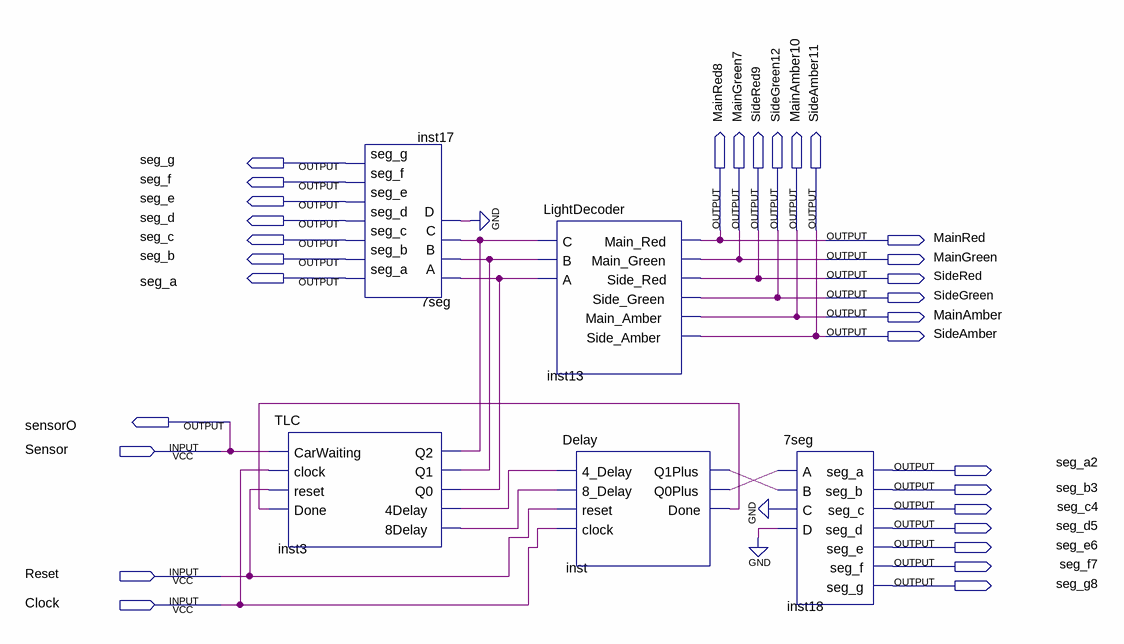
[diagram p0: schematic sheet]
// Quartus schematic All.bdf as structural Verilog: 5 symbols, 30 pins
module All (
  input  Sensor,
  input  Reset,
  input  Clock,
  output seg_g,
  output seg_f,
  output seg_e,
  output seg_d,
  output MainRed8,
  output MainGreen7,
  output SideRed9,
  output SideGreen12,
  output MainAmber10,
  output SideAmber11,
  output seg_c,
  output MainRed,
  output seg_b,
  output MainGreen,
  output seg_a,
  output SideRed,
  output SideGreen,
  output MainAmber,
  output SideAmber,
  output sensorO,
  output seg_a2,
  output seg_b3,
  output seg_c4,
  output seg_d5,
  output seg_e6,
  output seg_f7,
  output seg_g8
);

  wire inst3_4delay, inst3_8delay, inst3_q0, inst3_q1, inst3_q2, inst_done, inst_q0plus, inst_q1plus;

  TLC inst3 (
    .CarWaiting(Sensor), .clock(Clock), .reset(Reset), .Done(inst_done), .Q2(inst3_q2), .Q1(inst3_q1),
    .Q0(inst3_q0), .\4Delay (inst3_4delay), .\8Delay (inst3_8delay));
  \7seg  inst17 (
    .A(inst3_q0), .B(inst3_q1), .C(inst3_q2), .D(1'b0), .seg_a(seg_a), .seg_b(seg_b), .seg_c(seg_c),
    .seg_d(seg_d), .seg_e(seg_e), .seg_f(seg_f), .seg_g(seg_g));
  LightDecoder inst13 (
    .C(inst3_q2), .B(inst3_q1), .A(inst3_q0), .Main_Red(MainRed), .Main_Green(MainGreen), .Side_Red(SideRed),
    .Side_Green(SideGreen), .Main_Amber(MainAmber), .Side_Amber(SideAmber));
  Delay inst (
    .\4_Delay (inst3_4delay), .\8_Delay (inst3_8delay), .reset(Reset), .clock(Clock), .Q1Plus(inst_q1plus),
    .Q0Plus(inst_q0plus), .Done(inst_done));
  \7seg  inst18 (
    .A(inst_q0plus), .B(inst_q1plus), .C(1'b0), .D(1'b0), .seg_a(seg_a2), .seg_b(seg_b3), .seg_c(seg_c4),
    .seg_d(seg_d5), .seg_e(seg_e6), .seg_f(seg_f7), .seg_g(seg_g8));

  assign MainAmber10 = MainAmber;
  assign MainGreen7 = MainGreen;
  assign MainRed8 = MainRed;
  assign sensorO = Sensor;
  assign SideAmber11 = SideAmber;
  assign SideGreen12 = SideGreen;
  assign SideRed9 = SideRed;
endmodule
